# Altium schematic sheet current_sensing.SchDoc
size Letter; DrawnBy: Robson Souza; SheetNumber: 4; SheetTotal: 9
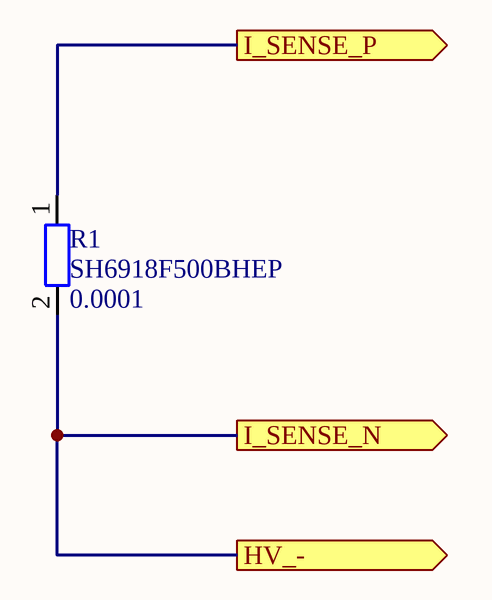
[diagram p0: current_sensing.SchDoc]

## Parts
R1  SH6918F500BHEP  value 0.0001  [SH6918F500BHEP]

## Ports
HV_- (out), I_SENSE_N (out), I_SENSE_P (out)

## Nets
HV_-: R1.2 ; port I_SENSE_N, port HV_-
I_SENSE_P: R1.1 ; port I_SENSE_P

## Library data of the parts
R1 = Res2: Shunt 500A 0.0001ohm 25W; Published: 8-Jun-2000; LatestRevisionDate: 17-Jul-2002; LatestRevisionNote: Re-released for DXP Platform.; PackageReference: AXIAL-0.4; Publisher: Altium Limited; PackageDescription: Axial Device, Thru-Hole; 2 Leads; 0.4 in Pin Spacing